# Altium schematic sheet Sheet.SchDoc: 增益自动切换电压放大电路
size A4
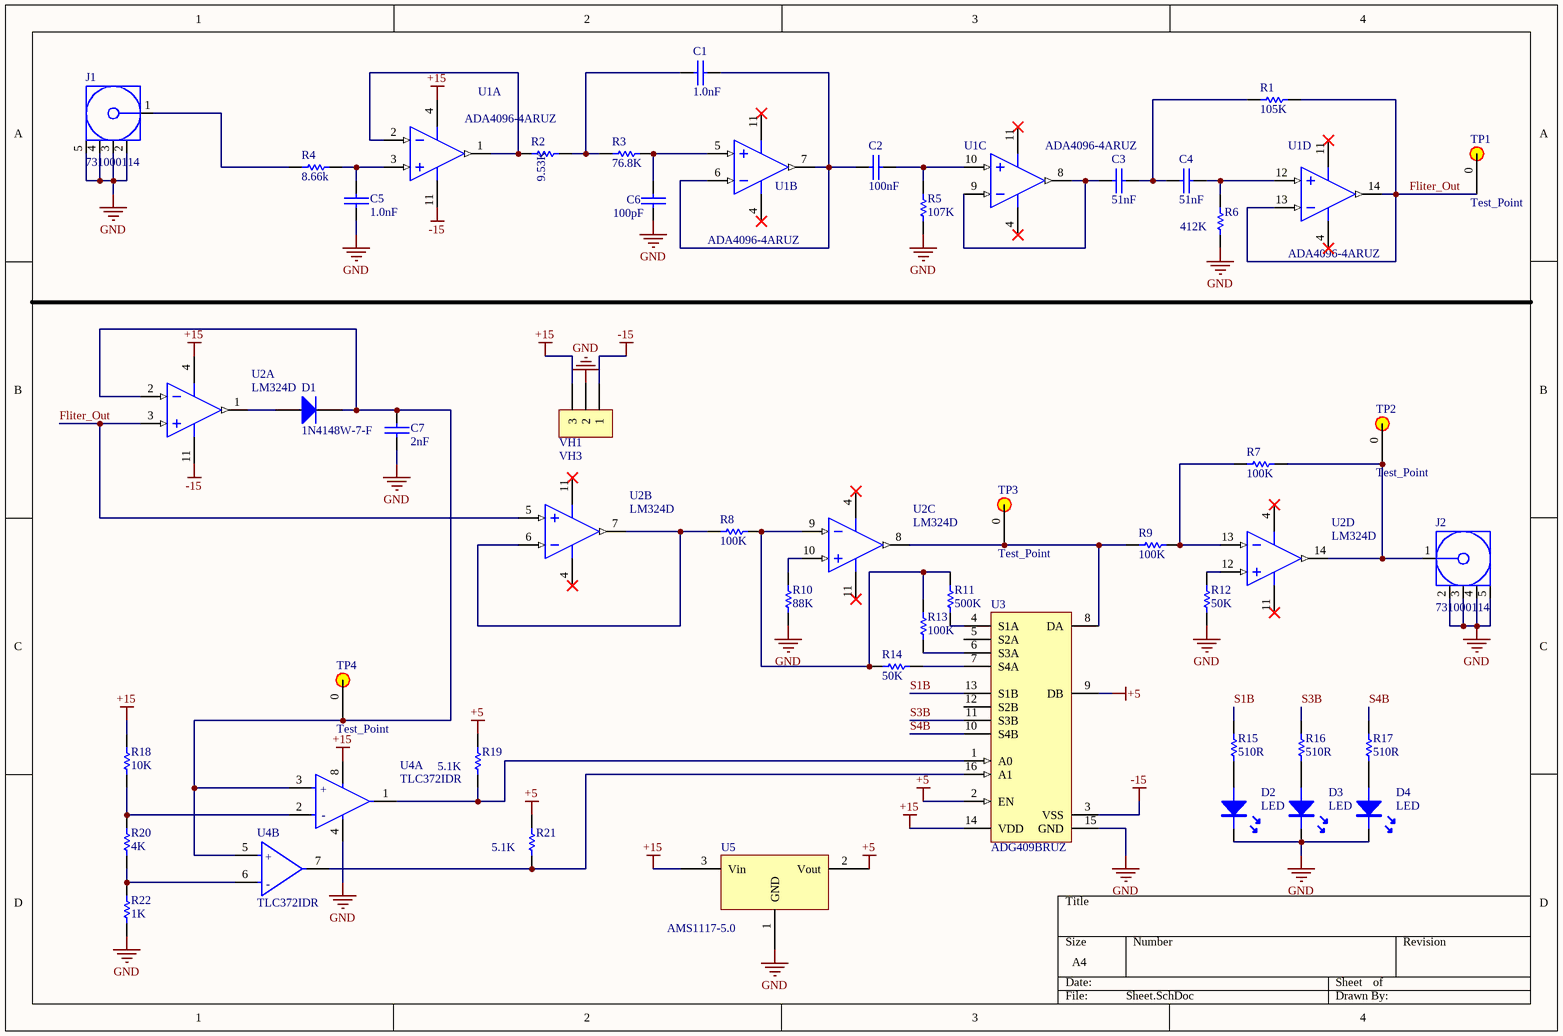
[diagram p0: Sheet.SchDoc]

## Parts
C1  1.0nF  [0805C]
C2  100nF  [0805C]
C3  51nF  [0805C]
C4  51nF  [0805C]
C5  1.0nF  [0805C]
C6  100pF  [0805C]
C7  2nF  [0805C]
D1  1N4148W-7-F  [DIOD-SOD123-2_V]
D2  LED  [LED-0805R]
D3  LED  [LED-0805R]
D4  LED  [LED-0805R]
J1  731000114  [MOLX-731000114_V]
J2  731000114  [MOLX-731000114_V]
R1  105K  [0805R]
R2  9.53K  [0805R]
R3  76.8K  [0805R]
R4  8.66k  [0805R]
R5  107K  [0805R]
R6  412K  [0805R]
R7  100K  [0805R]
R8  100K  [0805R]
R9  100K  [0805R]
R10  88K  [0805R]
R11  500K  [0805R]
R12  50K  [0805R]
R13  100K  [0805R]
R14  50K  [0805R]
R15  510R  [0805R]
R16  510R  [0805R]
R17  510R  [0805R]
R18  10K  [0805R]
R19  5.1K  [0805R]
R20  4K  [0805R]
R21  5.1K  [0805R]
R22  1K  [0805R]
TP1  Test_Point  [TestPoint FootPrint]
TP2  Test_Point  [TestPoint FootPrint]
TP3  Test_Point  [TestPoint FootPrint]
TP4  Test_Point  [TestPoint FootPrint]
U1  ADA4096-4ARUZ  [ADI-RU-14_L]  (parts A,B,C,D of 4)
U2  LM324D  [D0014A_L]  (parts A,B,C,D of 4)
U3  ADG409BRUZ  [ADI-RU-16_N]
U4  TLC372IDR  [FP-D0008A-MFG]  (parts A,B of 2)
U5  AMS1117-5.0  [SOT223]
VH1  VH3  [VH3.96-3A]

## Nets
+5: R19.2 R21.2 U3.2(EN) U3.9(DB) U5.2(Vout)
+15: R18.2 U1.4(+V) U2.4(VCC) U3.14(VDD) U4.8(VCC) U5.3(Vin) VH1.3
-15: U1.11(-V) U2.11(GND) U3.3(VSS) VH1.1
GND: C5.1 C6.1 C7.2 D2.K D3.K D4.K J1.2 J1.3 J1.4 J1.5 J2.2 J2.3 J2.4 J2.5 R5.1 R6.1 R10.2 R12.2 R22.1 U3.15(GND) U4.4(GND) U5.1(GND) VH1.2
Fliter_Out: R1.1 TP1.0 U1.13(-IN_D) U1.14(OUT_D) U2.3(1IN+) U2.5(2IN+)
S1B: R15.1 U3.13(S1B)
S3B: R16.1 U3.11(S3B)
S4B: R17.1 U3.10(S4B)
NetC1_1: C1.1 C2.2 U1.6(-IN_B) U1.7(OUT_B)
NetC1_2: C1.2 R2.2 R3.1
NetC2_1: C2.1 R5.2 U1.10(+IN_C)
NetC3_1: C3.1 C4.2 R1.2
NetC3_2: C3.2 U1.8(OUT_C) U1.9(-IN_C)
NetC4_1: C4.1 R6.2 U1.12(+IN_D)
NetC5_2: C5.2 R4.2 U1.3(+IN_A)
NetC6_2: C6.2 R3.2 U1.5(+IN_B)
NetC7_1: C7.1 D1.2(K) TP4.0 U2.2(1IN-) U4.3(1IN+) U4.5(2IN+)
NetD1_1: D1.1(A) U2.1(1OUT)
NetD2_A: D2.A R15.2
NetD3_A: D3.A R16.2
NetD4_A: D4.A R17.2
NetJ1_1: J1.1 R4.1
NetJ2_1: J2.1 R7.1 TP2.0 U2.14(4OUT)
NetR2_1: R2.1 U1.1(OUT_A) U1.2(-IN_A)
NetR7_2: R7.2 R9.1 U2.13(4IN-)
NetR8_1: R8.1 R11.2 R13.2 R14.2 U2.9(3IN-)
NetR8_2: R8.2 U2.6(2IN-) U2.7(2OUT)
NetR9_2: R9.2 TP3.0 U2.8(3OUT) U3.8(DA)
NetR10_1: R10.1 U2.10(3IN+)
NetR11_1: R11.1 U3.4(S1A)
NetR12_1: R12.1 U2.12(4IN+)
NetR13_1: R13.1 U3.6(S3A)
NetR14_1: R14.1 U3.7(S4A)
NetR18_1: R18.1 R20.2 U4.2(1IN-)
NetR19_1: R19.1 U3.1(A0) U4.1(1OUT)
NetR20_1: R20.1 R22.2 U4.6(2IN-)
NetR21_1: R21.1 U3.16(A1) U4.7(2OUT)

Not connected (* = marked no-connect by the designer): U3 5(S2A) 12(S2B)

## Notes on the sheet
- (in symbol CMP-04896-000010-1, part A) +; -
- (in symbol CMP-04896-000010-1, part B) +; -

## Library data of the parts
C1-C7 = CAP: 无极性电容
D1 = CMP-2000-04932-2: Fast Switching Diode, 100 V, 0.15 A, -65 to 150 degC, 2-Pin?SOD123, RoHS, Tape and Reel; Recovery Time: 4ns; Brand: DiodesIncorporated; Unit Weight: 0.000353oz; Max Surge Current: 2A; Peak Reverse Voltage: 100V; Ir - Reverse Current: 1uA; Vf - Forward Voltage: 1.25V; Configuration: Single; If - Forward Current: 0.15A; Product Category: Diodes-GeneralPurpose,Power,Switching; Operating Temperature Range: -65Cto+150C; Packaging: Reel; Manufacturer URL: http://www.diodes.com/; Maximum Operating Temperature: +150C; Height: 1.25mm; Minimum Operating Temperature: -65C; Product: SwitchingDiodes; Package URL: http://www.diodes.com/datasheets/ds18004.pdf; Type: SwitchingDiode; Package Reference: SOD123-2; Width: 1.7mm; Datasheet URL: http://www.farnell.com/datasheets/1915529.pdf; Datasheet Version: Rev. 24-2, 10/2013; Series: 1N4148; Factory Pack Quantity: 3000; Length: 2.85mm; RoHS: True; Manufacturer: DiodesIncorporated; Mounting Style: SMD/SMT; Package / Case: SOD-123
J1 J2 = CMP-2000-05487-1: SMA Right-Angle PCB Jack Receptacle, Brass Body, Gold Plated, 50 Ohm, 5-Pin THD, RoHS, Tray; Manufacturer: Molex; Datasheet Version: 09/2016; Package Description: 5-Pin Through Hole Device, Body 14.8 x 6.35 mm, Pitch 2.54 mm; Datasheet URL: http://www.molex.com/webdocs/datasheets/pdf/en-us/0731000114_RF_COAX_CONNECTORS.pdf; Manufacturer URL: http://www.molex.com/; Package Reference: 731000114; Mounting Technology: ThroughHole; Package URL: http://www.molex.com/pdm_docs/sd/731000114_sd.pdf
R1-R22 = RES
U1 = ADA4096-4ARUZ: Quad Channel RRIO Operational Amplifier, 800 KHz BW, 400 mV/us SR, Industrial, 14-pin SOP (RU-14), Tube; Manufacturer: Analog Devices; Amplifiers Per Package: 4; Small Signal Bandwidth: 800KHz; V Span Min: 3V; Iq/Amp: 60uA; Input Bias Current: 3nA; V Span Max: 30V; Input Offset Voltage: 35uV; PartNumber: ADA4096-4ARUZ; ComponentLink1Description: Manufacturer URL; ComponentLink2Description: Datasheet; DatasheetVersion: Rev. C; ComponentLink3URL: http://www.analog.com/static/imported-files/packages/36057385283879153717235186773RU14.pdf; ComponentLink3Description: Package Specification; ComponentLink1URL: http://www.analog.com/en/index.html; Code_JEDEC: MO-153AB-1; Packing: Tube; ComponentLink2URL: http://www.analog.com/static/imported-files/data_sheets/ADA4096-2_4096-4.pdf; Generic Part Number: ADA4096-4; Slew Rate: 400mV/us; Mounting Technology: Surface Mount; PackageReference: RU-14; PackageDescription: 14-Pin Thin Shrink Small Outline Package, Body 5 x 4.4 mm, Pitch 0.65 mm
U2 = CMP-2000-06547-1: Quadruple Operational Amplifier, 0.5 V/us, 1.2 MHz, 3 to 32 V, 0 to 70 degC, 14-Pin SOIC (D), Green (RoHS & no Sb/Br), Tube; Manufacturer: Texas Instruments; Unity Gain Bandwidth Product: 1.2MHz; Input Offset Voltage: 7mV; Dual Supply Voltage (Max): ±16V; Single Supply Voltage (Min): 3V; Single Supply Voltage (Max): 32V; Voltage Gain in dB: 100dB; Power Supply Requirement: Single/Dual; Input Bias Current: 250nA; Dual Supply Voltage (Min): ±1.5V; Single Supply Voltage (Typ): 5/9/12/15/18/24/28V; Dual Supply Voltage (Typ): ±3/±5/±9/±12/±15V; Number of  Elements: 4; Common Mode Rejection Ratio: 65dB; Datasheet Version: Rev. W, 03/2015; Technology: Bipolar; Shut Down Feature: No; Package Reference: D0014A; Type: GeneralPurposeAmplifier; Pin Count: 14; Package Type: SOIC; Rail/Rail I/O Type: No; Manufacturer URL: http://www.ti.com/; Package Description: 14-Pin Small Outline Integrated Circuit, Body 8.65 x 3.9 mm, Pitch 1.27 mm; Operating Temperature Classification: Commercial; Datasheet URL: http://www.ti.com/lit/ds/symlink/lm324.pdf; Slew Rate: 0.5V/us; Package URL: http://www.ti.com/lit/ml/mpds177g/mpds177g.pdf; Mounting: SurfaceMount; Packaging: Rail/Tube; Mounting Technology: SurfaceMount; Operating Temp Range: 0Cto70C
U3 = CMP-0793-00115-1: LC2MOS 4-Channel High Performance Analog Multiplexer, 40 Ohm / 90 Ohm Ron, 16-pin SOP (RU-16), Tube; Manufacturer: Analog Devices; Max Analog Signal Range: Vss to Vdd; t transition (s): 120n; Ron (ohms): 40; ComponentLink1URL: http://www.analog.com/en/index.html; Packing: Tube; DatasheetVersion: Rev. C; Code_JEDEC: MO-153AB; ComponentLink1Description: Manufacturer URL; PackageVersion: Nov-02; ComponentLink3URL: http:/www.analog.com/static/imported-files/packages/36244347913743854010197452789RU16.pdf; PackageReference: RU-16; PackageDescription: 16-Pin Thin Shrink Small Outline Package, Body 5 x 4.4 mm, Pitch 0.65 mm; Mounting Technology: Surface Mount; PartNumber: ADG409BRUZ; ComponentLink2URL: http://www.analog.com/static/imported-files/data_sheets/ADG408_409.pdf; ComponentLink3Description: Package Specification; ComponentLink2Description: Datasheet
U4 = CMP-04896-000010-1: IC DIFF COMP DUAL 8-SOIC; Manufacturer: Texas Instruments; Input Bias Current: 0.000005uA; Nominal Supply Current: 150uA; Max Dual Supply Voltage: 18V; Input Offset Voltage: 1mV; Min Supply Voltage: 3V; Max Supply Voltage: 16V; Response Time: 200-650ns; Min Dual Supply Voltage: 2V; Standoff Height: 0.11mm; Number Of Channels: 2; Temperature Range High: +85°C; Mouser Description: Analog Comparators Dual LinCMOS Differential; Device Class L1: Integrated Circuits (ICs); ComponentLink2Description: Datasheet; Lead Free: Yes; Ipc Land Pattern Name: SOIC127P600X175-8; RoHS: TRUE; Temperature Range Low: -40°C; Ambient Temperature Range Low: -40°C; Height: 1.75mm; Octopart: https://octopart.com/tlc372idr-texas+instruments-841294; Device Class L3: Comparators; Temperature: -40°C to +85°C; Manufacturer Part Number: TLC372IDR; Ambient Temperature Range High: +85°C; Digikey Description: IC DIFF COMP DUAL 8-SOIC; Automotive: No; ComponentLink2URL: http://www.ti.com/lit/ds/symlink/tlc372.pdf; Category: IC; Package: D0008A; Device Class L2: Linear ICs
U5 = AMS1117: 三端稳压芯片